# EAGLE design dev_efm32_tg (EAGLE 6.5.0)
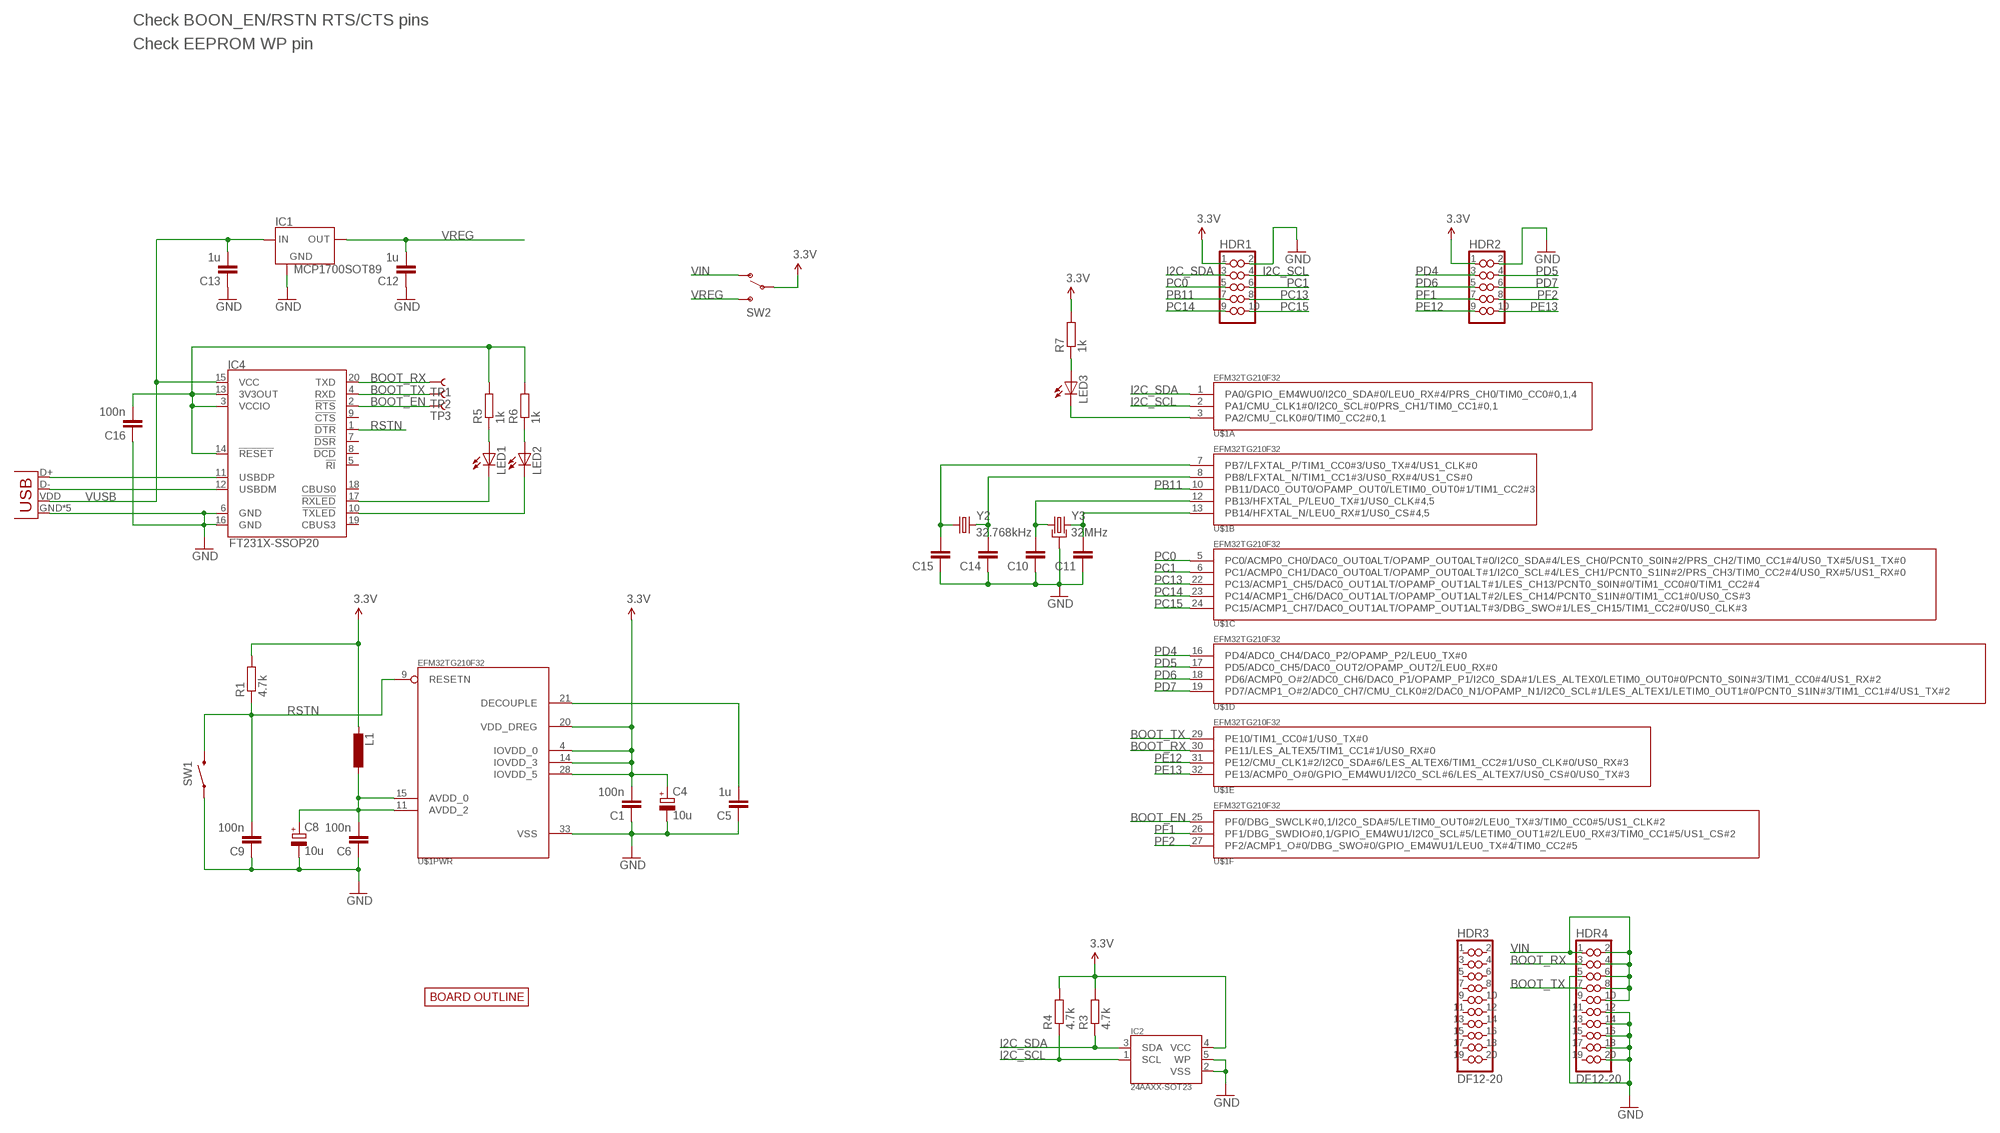
[diagram p0: schematic, sheet 1]

## Parts
C1  100n  C-0402  [0402]
C4  10u  CPOL-A  [CAP_CASE_A]
C5  1u  C-0402  [0402]
C6  100n  C-0402  [0402]
C8  10u  CPOL-A  [CAP_CASE_A]
C9  100n  C-0402  [0402]
C10  C-0402  [0402]
C11  C-0402  [0402]
C12  1u  C-0402  [0402]
C13  1u  C-0402  [0402]
C14  C-0402  [0402]
C15  C-0402  [0402]
C16  100n  C-0402  [0402]
HDR1  HDR2X05-ROUND  [2X05ROUND]
HDR2  HDR2X05-ROUND  [2X05ROUND]
HDR3  DF12-20  [DF12_20_MF]
HDR4  DF12-20  [DF12_20_MF]
IC1  MCP1700SOT89  [SOT89]
IC2  24AAXX-SOT23  [SOT23-5]
IC4  FT231X-SSOP20  [SSOP20]
L1  L-0402  [0402]
LED1  LED0603  [LED-0603]
LED2  LED0603  [LED-0603]
LED3  LED0603  [LED-0603]
R1  4.7k  R-0402  [0402]
R3  4.7k  R-0402  [0402]
R4  4.7k  R-0402  [0402]
R5  1k  R-0402  [0402]
R6  1k  R-0402  [0402]
R7  1k  R-0402  [0402]
SW1  SWITCH_TACTILE-B3U-1000P  [B3U-1000P]
SW2  SWITCH_SPDT-PCM  [PCM12SMTR]
TP1  TP_1X1-1  [TP_1X1_1]
TP2  TP_1X1-1  [TP_1X1_1]
TP3  TP_1X1-1  [TP_1X1_1]
U$1  EFM32TG210F32  [QFN32]
U$2  USB-MICRO  [10118194_0001LF]
U$3  QK-OUTLINE  [QK-OUTLINE]
Y2  32.768kHz  CRYSTAL-2-ABS07  [ABS07]
Y3  32MHz  CRYSTAL-4-ABM8G  [ABM8G]

## Nets
3.3V: C1.2 C4.1(+) HDR1.1 HDR2.1 IC2.4(VCC) L1.2 R1.2 R3.2 R4.2 R7.2 SW2.2(COM) U$1.4(PWR:IOVDD_0) U$1.14(PWR:IOVDD_3) U$1.20(PWR:VDD_DREG) U$1.28(PWR:IOVDD_5)
AVDD: C6.2 C8.1(+) L1.1 U$1.11(PWR:AVDD_2) U$1.15(PWR:AVDD_0)
BOOT_EN: IC4.2(!RTS) TP3.P$1 U$1.25(F:PF0/DBG_SWCLK#0,1/I2C0_SDA#5/LETIM0_OUT0#2/LEU0_TX#3/TIM0_CC0#5/US1_CLK#2)
BOOT_RX: HDR4.3 IC4.20(TXD) TP1.P$1 U$1.30(E:PE11/LES_ALTEX5/TIM1_CC1#1/US0_RX#0)
BOOT_TX: HDR4.7 IC4.4(RXD) TP2.P$1 U$1.29(E:PE10/TIM1_CC0#1/US0_TX#0)
GND: C1.1 C4.2(-) C5.1 C6.1 C8.2(-) C9.1 C10.1 C11.1 C12.1 C13.1 C14.1 C15.1 C16.1 HDR1.2 HDR2.2 HDR4.5 HDR4.12 HDR4.14 HDR4.16 HDR4.18 HDR4.20 IC1.1(GND) IC2.2(VSS) IC2.5(WP) IC4.6(GND) IC4.16(GND) SW1.P$1 U$1.33(PWR:VSS) U$2.GND U$2.PAD1(GND) U$2.PAD2(GND) U$2.SHIELD1(GND) U$2.SHIELD2(GND) Y3.2(SHIELD) Y3.4(SHIELD)
I2C_SCL: HDR1.4 IC2.1(SCL) R4.1 U$1.2(A:PA1/CMU_CLK1#0/I2C0_SCL#0/PRS_CH1/TIM0_CC1#0,1)
I2C_SDA: HDR1.3 IC2.3(SDA) R3.1 U$1.1(A:PA0/GPIO_EM4WU0/I2C0_SDA#0/LEU0_RX#4/PRS_CH0/TIM0_CC0#0,1,4)
N$2: C5.2 U$1.21(PWR:DECOUPLE)
N$3: C11.2 U$1.13(B:PB14/HFXTAL_N/LEU0_RX#1/US0_CS#4,5) Y3.3
N$5: C14.2 U$1.8(B:PB8/LFXTAL_N/TIM1_CC1#3/US0_RX#4/US1_CS#0) Y2.P$2
N$6: C10.2 U$1.12(B:PB13/HFXTAL_P/LEU0_TX#1/US0_CLK#4,5) Y3.1
N$7: C15.2 U$1.7(B:PB7/LFXTAL_P/TIM1_CC0#3/US0_TX#4/US1_CLK#0) Y2.P$1
N$8: IC4.11(USBDP) U$2.D+
N$9: IC4.12(USBDM) U$2.D-
N$10: LED1.A R5.1
N$11: LED2.A R6.1
N$12: IC4.17(!RXLED) LED1.C
N$13: IC4.10(!TXLED) LED2.C
N$14: LED3.A R7.1
N$15: LED3.C U$1.3(A:PA2/CMU_CLK0#0/TIM0_CC2#0,1)
N$20: C16.2 IC4.3(VCCIO) IC4.13(3V3OUT) IC4.14(!RESET) R5.2 R6.2
PB11: HDR1.7 U$1.10(B:PB11/DAC0_OUT0/OPAMP_OUT0/LETIM0_OUT0#1/TIM1_CC2#3)
PC0: HDR1.5 U$1.5(C:PC0/ACMP0_CH0/DAC0_OUT0ALT/OPAMP_OUT0ALT#0/I2C0_SDA#4/LES_CH0/PCNT0_S0IN#2/PRS_CH2/TIM0_CC1#4/US0_TX#5/US1_TX#0)
PC1: HDR1.6 U$1.6(C:PC1/ACMP0_CH1/DAC0_OUT0ALT/OPAMP_OUT0ALT#1/I2C0_SCL#4/LES_CH1/PCNT0_S1IN#2/PRS_CH3/TIM0_CC2#4/US0_RX#5/US1_RX#0)
PC13: HDR1.8 U$1.22(C:PC13/ACMP1_CH5/DAC0_OUT1ALT/OPAMP_OUT1ALT#1/LES_CH13/PCNT0_S0IN#0/TIM1_CC0#0/TIM1_CC2#4)
PC14: HDR1.9 U$1.23(C:PC14/ACMP1_CH6/DAC0_OUT1ALT/OPAMP_OUT1ALT#2/LES_CH14/PCNT0_S1IN#0/TIM1_CC1#0/US0_CS#3)
PC15: HDR1.10 U$1.24(C:PC15/ACMP1_CH7/DAC0_OUT1ALT/OPAMP_OUT1ALT#3/DBG_SWO#1/LES_CH15/TIM1_CC2#0/US0_CLK#3)
PD4: HDR2.3 U$1.16(D:PD4/ADC0_CH4/DAC0_P2/OPAMP_P2/LEU0_TX#0)
PD5: HDR2.4 U$1.17(D:PD5/ADC0_CH5/DAC0_OUT2/OPAMP_OUT2/LEU0_RX#0)
PD6: HDR2.5 U$1.18(D:PD6/ACMP0_O#2/ADC0_CH6/DAC0_P1/OPAMP_P1/I2C0_SDA#1/LES_ALTEX0/LETIM0_OUT0#0/PCNT0_S0IN#3/TIM1_CC0#4/US1_RX#2)
PD7: HDR2.6 U$1.19(D:PD7/ACMP1_O#2/ADC0_CH7/CMU_CLK0#2/DAC0_N1/OPAMP_N1/I2C0_SCL#1/LES_ALTEX1/LETIM0_OUT1#0/PCNT0_S1IN#3/TIM1_CC1#4/US1_TX#2)
PE12: HDR2.9 U$1.31(E:PE12/CMU_CLK1#2/I2C0_SDA#6/LES_ALTEX6/TIM1_CC2#1/US0_CLK#0/US0_RX#3)
PE13: HDR2.10 U$1.32(E:PE13/ACMP0_O#0/GPIO_EM4WU1/I2C0_SCL#6/LES_ALTEX7/US0_CS#0/US0_TX#3)
PF1: HDR2.7 U$1.26(F:PF1/DBG_SWDIO#0,1/GPIO_EM4WU1/I2C0_SCL#5/LETIM0_OUT1#2/LEU0_RX#3/TIM0_CC1#5/US1_CS#2)
PF2: HDR2.8 U$1.27(F:PF2/ACMP1_O#0/DBG_SWO#0/GPIO_EM4WU1/LEU0_TX#4/TIM0_CC2#5)
RSTN: C9.2 IC4.1(!DTR) R1.1 SW1.P$2 U$1.9(PWR:RESETN)
VIN: HDR4.1 HDR4.2 HDR4.4 HDR4.6 HDR4.8 HDR4.10 SW2.1
VREG: C12.2 IC1.3(OUT) SW2.3
VUSB: C13.2 IC1.2(IN) IC1.4(IN) IC4.15(VCC) U$2.VDD(VBUS)
Unconnected: HDR3.1 HDR3.2 HDR3.3 HDR3.4 HDR3.5 HDR3.6 HDR3.7 HDR3.8 HDR3.9 HDR3.10 HDR3.11 HDR3.12 HDR3.13 HDR3.14 HDR3.15 HDR3.16 HDR3.17 HDR3.18 HDR3.19 HDR3.20 HDR4.9 HDR4.11 HDR4.13 HDR4.15 HDR4.17 HDR4.19 IC4.5(!RI) IC4.7(!DSR) IC4.8(!DCD) IC4.9(!CTS) IC4.18(CBUS0) IC4.19(CBUS3)

## Notes on the sheet
- Check BOON_EN/RSTN RTS/CTS pins
- Check EEPROM WP pin

## Library data of the parts
C1 C5 C6 C9-C16 = _myeaglelib:C: Non-Polarized Capacitors
C4 C8 = _myeaglelib:CPOL: Polarized Capacitors Variants: AVE (CDE Cornell Dubilier)
HDR1 HDR2 = _myeaglelib:HDR2X05
HDR3 HDR4 = _myeaglelib:DF12-20
IC1 = _myeaglelib:MCP1700
IC2 = _myeaglelib:24AAXX: Microchip I2C Serial EEPROM
IC4 = _myeaglelib:FT231X
L1 = _myeaglelib:L: Inductors
LED1-LED3 = _myeaglelib:LED: LEDs Standard schematic elements and footprints for 5mm, 3mm, 1206, and 0603 sized LEDs. 5mm - Spark Fun Electronics SKU : COM-00529 (and others)
R1 R3-R7 = _myeaglelib:R: Resistors
SW1 = _myeaglelib:SWITCH_TACTILE: Tactile switches
SW2 = _myeaglelib:SWITCH_SPDT: SPDT Switches
TP1-TP3 = _myeaglelib:TP_1X1: Bare copper test points for troubleshooting or ICT
U$1 = EnergyMicro:EFM32TG210F32: EFM32TG210F32 Tiny Microcontroller in 6mm x 6mm QFN32 package
U$2 = _myeaglelib:USB
U$3 = _myeaglelib:QK-OUTLINE
Y2 = _myeaglelib:CRYSTAL-2: Crystals
Y3 = _myeaglelib:CRYSTAL-4

## Board
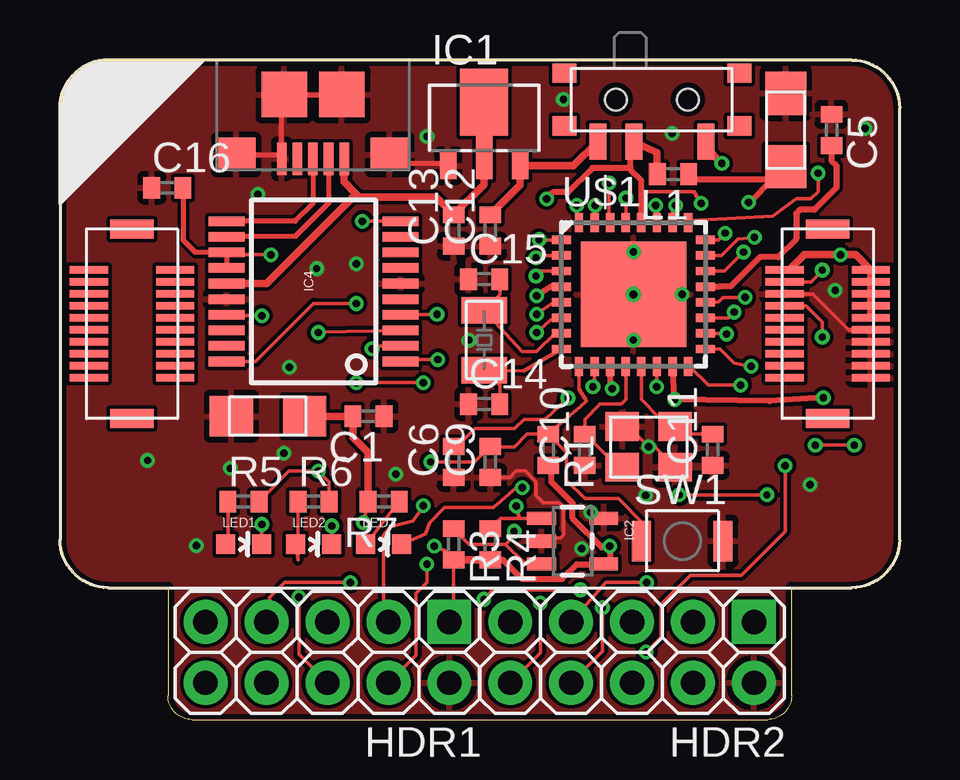
[diagram p1: board, top side]
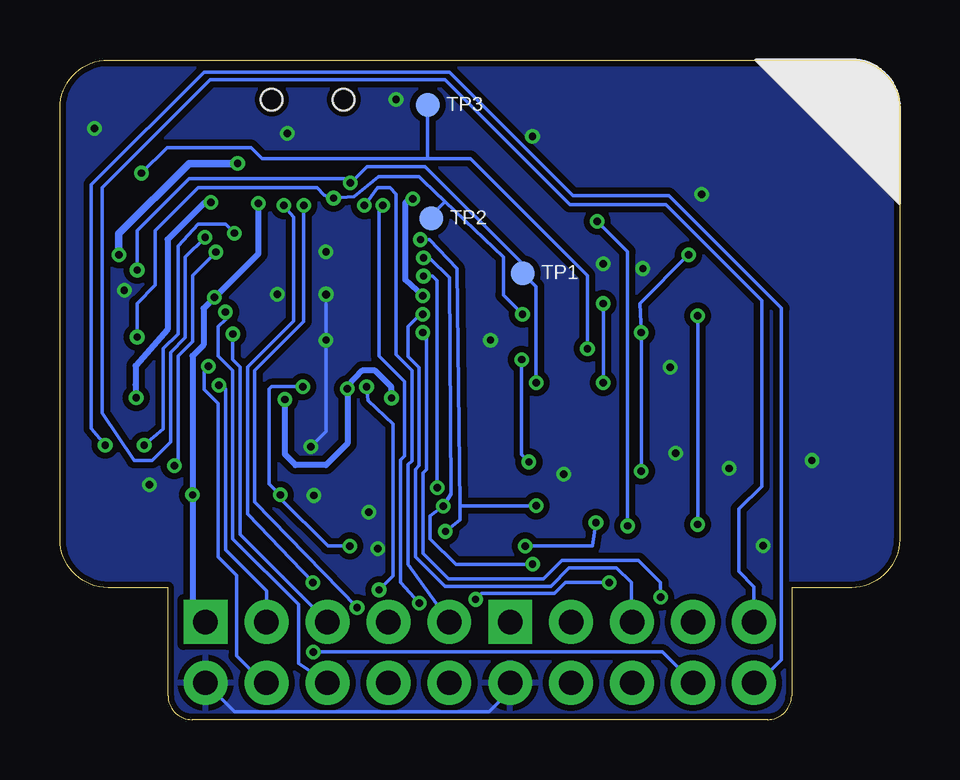
[diagram p2: board, bottom side, seen from below]

Size 35 x 27.5 mm. Coordinates in mm from the lower left corner, seen from the top.
Outline: 5.5,0 29.5,0 arc90 30.5,1 30.5,5.5 33,5.5 arc90 35,7.5 35,25.5 arc90 33,27.5 2,27.5 arc90 0,25.5 0,7.5 arc90 2,5.5 4.5,5.5 4.5,1 arc90 5.5,0
Copper layers (1*16): Top 0.035mm / dielectric 1.5mm / Bottom 0.035mm
Design rules "ITead_rule": minimum track width 6mil, minimum drill 12mil, track to track 6mil, track to pad 6mil, pad to pad 6mil, via to via 6mil, smd to smd 0mil, copper to edge 10mil, drill to drill 10mil, minimum pad ring 10mil, minimum via ring 6mil, stop-mask expansion 2mil, vias tented up to drill 100mil, thermal gap 10mil

### Footprints (pad centres in the part's own frame; a part is rotated, then mirrored left to right if it is on the bottom)
0402 = smd 0.7 x 0.9: 1 -0.65,0; 2 0.65,0
CAP_CASE_A = smd 1.8 x 1.7: 1 -1.525,0; 2 1.525,0
2X05ROUND = drill 1.016 pad 1.829 square: 1 -1.27,-1.27 | drill 1.016 pad 1.829: 2 -1.27,1.27; 3 1.27,-1.27; 4 1.27,1.27; 5 3.81,-1.27; 6 3.81,1.27; 7 6.35,-1.27; 8 6.35,1.27; 9 8.89,-1.27; 10 8.89,1.27
DF12_20_MF = smd 0.3 x 1.6: 1 -2.25,-1.8; 2 -2.25,1.8; 3 -1.75,-1.8; 4 -1.75,1.8; 5 -1.25,-1.8; 6 -1.25,1.8; 7 -0.75,-1.8; 8 -0.75,1.8; 9 -0.25,-1.8; 10 -0.25,1.8; 11 0.25,-1.8; 12 0.25,1.8; 13 0.75,-1.8; 14 0.75,1.8; 15 1.25,-1.8; 16 1.25,1.8; 17 1.75,-1.8; 18 1.75,1.8; 19 2.25,-1.8; 20 2.25,1.8 | smd 0.8 x 1.8: MF1 -3.95,0; MF2 3.95,0
SOT89 = smd 0.7 x 1.1: 1 -1.5,-1.75; 3 1.5,-1.75 | smd 0.7 x 1.8: 2 0,-1.4 | smd 2 x 2.8: 4 0,0.9
SOT23-5 = smd 0.55 x 1.2: 1 -0.95,-1.3; 2 0,-1.3; 3 0.95,-1.3; 4 0.95,1.3; 5 -0.95,1.3
SSOP20 = smd 0.4 x 1.5: 1 -2.925,-3.625; 2 -2.275,-3.625; 3 -1.625,-3.625; 4 -0.975,-3.625; 5 -0.325,-3.625; 6 0.325,-3.625; 7 0.975,-3.625; 8 1.625,-3.625; 9 2.275,-3.625; 10 2.925,-3.625; 11 2.925,3.625; 12 2.275,3.625; 13 1.625,3.625; 14 0.975,3.625; 15 0.325,3.625; 16 -0.325,3.625; 17 -0.975,3.625; 18 -1.625,3.625; 19 -2.275,3.625; 20 -2.925,3.625
LED-0603 = smd 0.8 x 0.8: A 0,-0.75; C 0,0.75
B3U-1000P = smd 0.8 x 1.7: P$1 1.7,0; P$2 -1.7,0
PCM12SMTR = smd 0.7 x 1.5: 1 -2.25,1.75; 2 0.75,1.75; 3 2.25,1.75 | smd 1 x 0.8: PAD1 -3.65,1.1; PAD2 3.65,1.1; PAD3 -3.65,-1.1; PAD4 3.65,-1.1 | hole 0.9: 1.5,0; -1.5,0
TP_1X1_1 = smd 1 x 1: P$1 0,0
QFN32 = smd 0.8 x 0.35: 1 -3,2.275; 2 -3,1.625; 3 -3,0.975; 4 -3,0.325; 5 -3,-0.325; 6 -3,-0.975; 7 -3,-1.625; 8 -3,-2.275; 17 3,-2.275; 18 3,-1.625; 19 3,-0.975; 20 3,-0.325; 21 3,0.325; 22 3,0.975; 23 3,1.625; 24 3,2.275 | smd 0.35 x 0.8: 9 -2.275,-3; 10 -1.625,-3; 11 -0.975,-3; 12 -0.325,-3; 13 0.325,-3; 14 0.975,-3; 15 1.625,-3; 16 2.275,-3; 25 2.275,3; 26 1.625,3; 27 0.975,3; 28 0.325,3; 29 -0.325,3; 30 -0.975,3; 31 -1.625,3; 32 -2.275,3 | smd 4.4 x 4.4: 33 0,0
10118194_0001LF = smd 0.4 x 1.35: D+ 0,2.675; D- -0.65,2.675; GND 1.3,2.675; ID 0.65,2.675; VDD -1.3,2.675 | smd 1.6 x 1.4: PAD1 -3.2,2.5; PAD2 3.2,2.5 | smd 1.9 x 1.9: SHIELD1 -1.2,0; SHIELD2 1.2,0
ABS07 = smd 1.1 x 1.9: P$1 -1.25,0; P$2 1.25,0
ABM8G = smd 1.4 x 1.2: 1 -1.1,-0.85; 2 1.1,-0.85; 3 1.1,0.85; 4 -1.1,0.85

### Placement (x,y rotation side)
C1  12.86,12.64 180 top
C4  8.67,12.64 180 top
C5  32.16,24.58 270 top
C6  16.42,10.74 90 top
C8  30.26,24.58 90 top
C9  17.94,10.74 90 top
C10  21.88,11.25 90 top
C11  27.21,11.25 90 top
C12  17.94,20.39 90 top
C13  16.42,20.39 90 top
C14  17.69,13.15 0 top
C15  17.69,18.36 0 top
C16  4.48,22.17 0 top
HDR1  14.96,2.8 180 top
HDR2  27.66,2.8 180 top
HDR3  3,16.5 270 top
HDR4  32,16.5 270 top
IC1  17.69,24.84 0 top
IC2  21.37,7.44 270 top
IC4  10.57,17.85 90 top
L1  25.56,22.74 180 top
LED1  7.65,7.31 270 top
LED2  10.57,7.31 270 top
LED3  13.5,7.31 270 top
R1  20.35,11.25 270 top
R3  16.42,7.31 270 top
R4  17.94,7.31 270 top
R5  7.65,9.09 0 top
R6  10.57,9.09 0 top
R7  13.5,9.09 180 top
SW1  25.94,7.44 0 top
SW2  24.67,25.85 180 top
TP1  15.7,18.61 0 bottom
TP2  19.51,20.9 0 bottom
TP3  19.67,25.62 0 bottom
U$1  23.91,17.73 0 top
U$2  10.55,26.06 180 top
U$3  17.5,16.5 0 top
Y2  17.69,15.82 270 top
Y3  24.54,11.38 0 top

### Tracks (layer width: path | path; a pad name or v marks a point on that pad's centre or on a via)
3.3V  (via drill 0.3)
  Top 0.152: R4.2 18.21,6.66 | U$1.14 24.88,14.08 v24.87,13.88 | 22.92,6.74 IC2.4 | v25.81,9.37 v29.47,9.37 | HDR1.1 16.42,4.26 R3.2 16.42,6.88 v15.6,7.23 | v12.66,8.21 12.66,8.27 R7.2 | U$1.20 27.45,17.4 27.64,17.6 v28.56,17.6 | v26.73,21.52 26.42,22.02 24.23,22.02 | 20.48,10.47 R1.2
  Top 0.254: U$1.28 24.23,22.02 24.23,22.48 23.78,22.93 23.78,23.02 | 23.78,23.02 23.78,23.96 SW2.2 | U$1.4 20.48,18.05 v19.87,17.66 | 20.29,21.74 v20.29,21.71 20.56,21.98 21.18,21.98 22.19,23 23.76,23 23.78,23.02 | 22.92,6.74 v22.92,7.23 22.59,7.17 21.37,8.39 21.37,9.03 20.48,9.91 20.48,10.47 | R4.2 18.46,6.66 19.26,5.86 20.94,5.86 21.55,6.47 22.65,6.47 IC2.4
  Top 0.305: L1.2 24.89,23.64 SW2.2 | C4.1 C1.2 12.23,12.63 12.23,11.76 12.84,11.14 R7.2 | R3.2 R4.2
  Bottom 0.152: v24.87,13.88 26.18,13.88 26.27,13.79 26.27,9.83 v25.81,9.37 25.81,9.22 23.83,7.23 v22.92,7.23 | v15.6,7.23 12.81,7.23 v12.66,8.21
  Bottom 0.254: HDR2.1 29.2,4.07 29.47,4.34 v29.47,9.37 29.47,15.16 29.01,15.62 29.01,17.14 v28.56,17.6 26.73,19.43 v26.73,21.52 | v20.29,21.71 20.48,21.66 20.61,21.54 20.61,18.34 v19.87,17.66
AVDD  (via drill 0.3)
  Top 0.152: U$1.15 25.53,14.58 25.56,14.55 | C6.2 16.56,11.39 17.3,12.14 18.96,12.14 19.34,12.52 20.23,12.52 v21.18,13.41
  Top 0.254: U$1.11 22.93,13.87 v23.02,13.79 | U$1.15 25.56,14.7 v25.62,13.34 29.57,13.28 v31.82,13.42 | C8.1 29.73,22.52 | 29.73,22.52 28.76,21.56 v28.71,21.56 | L1.1 26.4,22.52 29.73,22.52
  Bottom 0.152: 23.08,13.83 v23.02,13.79
  Bottom 0.254: v21.18,13.41 21.18,13.86 21.86,14.55 22.4,14.55 22.98,13.93 23.08,13.83 | v28.71,21.56 28.96,21.56 30.51,20.01 30.51,16.27 31.85,14.74 31.85,13.97 v31.82,13.42 | v23.02,13.79 23.02,11.5 23.91,10.61 25.18,10.61 25.62,11.06 v25.62,13.34
BOOT_EN  (via drill 0.3)
  Top 0.152: IC4.2 13.12,15.58 v13.01,15.46 | v31.6,22.78 31.6,22.02 31.3,21.71 30.69,21.71 29.71,20.99 26.26,20.8 U$1.25
  Bottom 0.152: v13.01,15.46 13.01,18.51 17.89,23.39 19.72,23.39 | 19.72,23.39 26.58,23.39 27.03,23.85 30.54,23.85 v31.6,22.78 | TP3.P$1 19.67,23.44 19.72,23.39
BOOT_RX  (via drill 0.3)
  Top 0.152: HDR4.3 31.29,18.25 v31.78,18.74 | v22.89,22.37 22.89,20.77 U$1.30 | IC4.20 8.16,14.93 10.57,17.34 v12.35,17.34 | v15.15,14.04 v12.35,14.04
  Bottom 0.152: v31.78,18.74 31.78,20.39 29.62,22.55 23.13,22.55 v22.89,22.37 22.21,23.06 19.78,23.06 15.7,18.98 TP1.P$1 15.15,18.05 v15.15,14.04 | v12.35,14.04 v12.35,17.34
BOOT_TX  (via drill 0.3)
  Top 0.152: U$1.29 23.58,21.61 v23.59,21.74 | IC4.4 15.57,16.88 v15.72,16.9 | HDR4.7 31.12,17.25 31.78,16.58 v31.78,15.95
  Bottom 0.152: 18.94,21.59 19.87,22.48 20.02,22.63 21.73,22.63 22.74,21.8 v23.59,21.74 23.98,21.86 24.29,22.17 29.24,22.17 31.02,20.39 31.02,18.11 31.78,17.34 v31.78,15.95 | 18.94,21.59 16.52,19.27 16.52,17.7 v15.72,16.9 | TP2.P$1 19.52,21.02 18.94,21.59
GND  (via drill 0.3, 0.33)
  Top 0.152: HDR4.5 31.38,17.75 32.88,16.25 HDR4.12 | Y3.4 23.69,12.23 v24.54,11.38 24.79,11.38 Y3.2 | C9.1 18.75,10.09 19.02,10.36 19.4,10.36 19.84,9.91 19.84,9.34 20.16,9.03 20.8,9.03 20.99,8.84 20.99,7.69 20.86,7.56 20.2,7.56 IC2.2
  Top 0.203: U$2.PAD2 9.07,23.56 U$2.GND 9.25,25.96 U$2.SHIELD2 U$2.SHIELD1 | IC1.1 16.29,23.19 14.12,23.19 U$2.PAD1
  Bottom 0.152: U$1.33 23.91,12.01 v24.54,11.38 | HDR1.2 16.23,1.21 17.11,0.33 27.73,0.33 HDR2.2
  other vias: 5.68,7.25 9.57,14.69 20.99,25.85 24.42,9.34 17.05,15.82 12.35,19 33.56,24.65 23.91,17.73 14,10.23 22.13,8.64 21.75,7.12 31.27,9.79 9.33,11.11 8.25,21.9 25.53,24.44 32.32,17.9 7.11,10.47 15.3,24.31 3.65,10.8 10.7,18.8 23.91,19.5 23.91,15.82 25.94,17.73
  pour Top: 0,27.5 35,27.5 35,0 0,0
  pour Bottom (isolate 0.254): 0,27.5 35,27.5 35,0 0,0
I2C_SCL  (via drill 0.3)
  Top 0.152: IC2.1 19.15,8.39 | 19.15,8.39 18.37,8.39 R4.1 | U$1.2 19.95,19.35 v19.84,19.25 | v19.02,8.9 19.15,8.39 | v15.3,6.47 15.3,5.71 14.84,5.25 14.84,2.68 HDR1.4
  Bottom 0.152: v19.84,19.25 19.59,19.25 18.77,18.42 18.7,9.41 v19.02,8.9 19.57,8.48 19.57,7.54 18.5,6.47 v15.3,6.47
I2C_SDA  (via drill 0.3)
  Top 0.152: R3.1 16.42,7.95 17.05,7.31 18.57,7.31 | 18.57,7.31 19.34,6.55 20.01,6.55 IC2.3 | U$1.1 20.11,20 20.1,20.01 v19.97,20.01 | v18.93,7.84 18.96,7.69 18.57,7.31 | HDR1.3 13.69,4.1 13.48,4.47 13.5,7.71 13.76,8.04 14.71,8.29 v15.15,8.91
  Bottom 0.152: v19.97,20.01 19.59,20.01 18.45,18.8 18.32,8.91 | 18.32,8.91 18.32,8.33 v18.93,7.84 | v15.15,8.91 18.32,8.91
N$2
  Top 0.254: C5.2 32.16,23.29 32.37,23.08 32.37,22.17 31.45,21.26 30.84,21.26 30.69,21.1 30.69,20.04 29.93,19.27 29.17,19.27 27.95,18.05 27.49,18.05 27.48,18.05 U$1.21
N$3
  Top 0.152: U$1.13 24.23,13.34 24.97,12.6 25.27,12.6 Y3.3 25.97,11.9 C11.2
N$5
  Top 0.152: U$1.8 19.33,14.54 Y2.P$2 18.34,13.92 C14.2
N$6
  Top 0.152: Y3.1 23.25,10.53 C10.2 21.88,12.52 22.51,13.15 23.4,13.15 23.58,13.34 U$1.12
N$7
  Top 0.152: C15.2 18.34,17.72 Y2.P$1 19.27,15.34 19.87,15.34 20.63,16.1 U$1.7
N$8
  Top 0.203: U$2.D+ 10.55,21.51 9.81,20.77 IC4.11
N$9
  Top 0.203: U$2.D- 11.2,21.52 9.81,20.14 IC4.12
N$10
  Top 0.152: R5.1 7,7.28 LED1.A
N$11
  Top 0.152: R6.1 9.92,6.65 LED2.A
N$12  (via drill 0.3)
  Top 0.152: LED1.C 8.4,7.3 v8.41,8.14 | v8.41,16.84 6.99,16.84 IC4.17
  Bottom 0.152: v8.41,8.14 v8.41,16.84
N$13  (via drill 0.3)
  Top 0.152: LED2.C 11.32,7.3 v11.34,8.07 | v12.61,20.77 IC4.10
  Bottom 0.152: v11.34,8.07 11.34,19.5 v12.61,20.77
N$14
  Top 0.152: LED3.A 12.81,7.37 R7.1
N$15  (via drill 0.3)
  Top 0.152: U$1.3 20.06,18.7 v19.84,18.49 | v19.27,9.66 19.02,9.66 18.07,8.84 16.04,8.84 15.4,8.2 15.25,7.73 LED3.C
  Bottom 0.152: v19.84,18.49 19.46,18.49 19.27,18.3 v19.27,9.66
N$20  (via drill 0.3)
  Top 0.152: IC4.3 10.79,16.16 v10.77,16.14 | v8.8,19.38 7.05,19.38 IC4.13 | R5.2 8.54,9.09 8.54,9.34 9.56,10.36 v10.77,10.36 11.22,9.9 R6.2
  Top 0.203: IC4.14 IC4.13 5.65,19.48 5.13,20 C16.2
  Bottom 0.152: v8.8,19.38 10.83,17.34 v10.77,16.14 v10.77,10.36
PB11  (via drill 0.3)
  Top 0.152: U$1.10 22.28,14.07 v22.22,13.88 | v21.7,5.41 18.04,5.41 v17.67,5.01 | v12.1,5.71 9.36,5.71 8.75,5.1 8.75,4.21 HDR1.7
  Bottom 0.152: v22.22,13.88 22.16,13.3 21.11,12.33 21.11,5.99 v21.7,5.41 | v17.67,5.01 17.43,5.25 14.38,5.25 13.93,5.71 v12.1,5.71
PC0  (via drill 0.3)
  Top 0.152: U$1.5 20.59,17.4 v19.87,16.9
  Bottom 0.152: v19.87,16.9 20.02,16.84 20.48,16.38 20.48,15.13 20.02,14.68 20.02,10.59 20.18,10.44 20.18,6.78 18.96,5.56 14.54,5.56 13.77,6.32 11.79,6.32 11.18,5.71 11.18,4.1 HDR1.5
PC1  (via drill 0.3)
  Top 0.152: U$1.6 20.55,16.75 v19.87,16.14 | v9.96,5.1 9.96,2.72 HDR1.6
  Bottom 0.152: v19.87,16.14 19.72,15.92 19.72,10.44 19.87,10.28 19.87,6.93 18.8,5.86 14.84,5.86 14.08,6.62 10.88,6.62 9.96,5.71 v9.96,5.1
PC13  (via drill 0.3)
  Top 0.152: U$1.22 27.7,18.7 v28.49,19.49 | v30.23,10.59 30.23,7.84 28.41,6.02 26.27,6.02 25.05,4.8 25.05,3.42 v24.44,2.82
  Bottom 0.152: v28.49,19.49 29.47,18.51 29.47,15.77 30.08,15.16 30.08,10.74 v30.23,10.59 | HDR1.8 9.89,2.82 v24.44,2.82
PC14  (via drill 0.3)
  Top 0.152: U$1.23 27.57,19.35 28.25,20.04 v28.95,20.1
  Bottom 0.152: v28.95,20.1 29.78,19.27 29.78,15.92 30.39,15.31 30.39,11.57 31.15,10.8 31.91,10.8 33.24,12.77 33.24,22.17 28.73,26.68 18.96,26.68 13.75,21.47 9.75,21.47 5.75,17.47 5.75,9.72 6.7,8.77 6.7,6.17 6.07,5.54 HDR1.9
PC15  (via drill 0.3)
  Top 0.152: U$1.24 27.45,20 v27.73,20.28 | v33.12,11.44 v31.49,11.44 31.36,11.44
  Bottom 0.152: v27.73,20.28 28.1,20.65 29.23,20.65 30.08,19.73 30.08,16.07 30.69,15.46 30.69,12.11 v31.49,11.44 | HDR1.10 5.88,1.53 4.92,2.49 4.92,17.15 9.62,21.85 13.62,21.85 18.77,27 28.99,27 33.69,22.3 33.69,12.14 v33.12,11.44
PD4  (via drill 0.3)
  Top 0.152: U$1.16 26.25,14.73 27.03,13.94 v28.38,13.94
  Bottom 0.152: v28.38,13.94 28.1,13.79 28.1,7.08 26.39,5.37 HDR2.3
PD5  (via drill 0.3)
  Top 0.152: U$1.17 27.51,15.45 28.1,14.86 v28.81,14.73
  Bottom 0.152: v28.81,14.73 28.99,14.49 28.99,13.76 28.41,13.18 28.41,6.78 27.64,6.02 27.64,2.66 26.51,1.53 HDR2.4
PD6  (via drill 0.3)
  Top 0.152: U$1.18 27.46,16.1 v27.8,16.07
  Bottom 0.152: v27.8,16.07 27.8,15.01 27.49,14.7 27.49,7.71 HDR2.5
PD7  (via drill 0.3)
  Top 0.152: U$1.19 27.86,16.75 v28.1,16.99
  Bottom 0.152: v28.1,16.99 28.1,16.68 28.41,16.38 28.41,15.16 27.8,14.55 27.8,7.54 25.05,4.8 25.05,2.35 HDR2.6
PE12  (via drill 0.3)
  Top 0.152: 22.38,20.77 22.34,20.73 U$1.31 22.28,21.54 v22.31,21.43
  Bottom 0.152: HDR2.9 20.48,6.48 20.48,10.64 20.33,10.79 20.33,14.55 20.99,15.21 20.99,21.92 21.24,22.17 21.76,22.17 v22.31,21.43
PE13  (via drill 0.3)
  Top 0.152: v21.55,21.43 21.55,20.81 U$1.32 | v20.02,4.86 20.02,2.78 HDR2.10
  Bottom 0.152: v20.02,4.86 20.81,5.71 20.81,10.82 20.63,10.99 20.63,14.09 21.7,15.16 21.7,21.41 v21.55,21.43
PF1  (via drill 0.3)
  Top 0.152: U$1.26 25.53,21.31 v25.66,21.43 | v24.45,5.71 22.76,5.71 HDR2.7
  Bottom 0.152: v25.66,21.43 25.66,21.41 25.27,20.95 25.27,16.62 27.19,14.7 27.19,8.57 v24.45,5.71
PF2  (via drill 0.3)
  Top 0.152: v22.61,4.67 22.61,2.83 HDR2.8
  Top 0.254: U$1.27 24.88,21.29 v24.84,21.43
  Bottom 0.152: v24.84,21.43 24.84,16.59 26.88,14.55 26.88,9.06 v22.61,4.67
RSTN  (via drill 0.3)
  Top 0.152: R1.1 21.69,13.04 21.94,13.28 21.63,13.78 U$1.9 | R1.1 21.11,11.14 21.11,9.98 21.88,9.22 23.27,9.22 24.29,8.2 24.29,7.49 SW1.P$2 | R1.1 19.48,11.9 18.96,11.38 17.95,11.38 C9.2 17.29,10.74 v15.45,10.74 | IC4.1 14.28,15.01 v15.76,15.01
  Bottom 0.152: v15.76,15.01 15.76,11.04 v15.45,10.74
VIN  (via drill 0.3)
  Top 0.305: SW2.1 26.92,23.86 v27.59,23.19 | HDR4.1 30.4,18.75 31.02,19.38 v32.55,19.38 33.17,19.38 HDR4.2 HDR4.4 HDR4.6 HDR4.8 HDR4.10
  Bottom 0.305: v27.59,23.19 29.62,23.19 32.55,20.27 v32.55,19.38
VREG
  Top 0.305: C12.2 19.19,22.29 IC1.3 21.41,23.09 SW2.3
VUSB
  Top 0.203: IC1.4 IC1.2
  Top 0.305: U$2.VDD 11.85,22.42 12.35,21.92 | 12.35,21.92 12.48,21.79 15.67,21.79 C13.2 17.69,22.31 IC1.2 | IC4.15 8.61,18.18 12.35,21.92